# Altium schematic sheet Sheet2_Hierarquia.SchDoc
size A4; SheetNumber: 2; SheetTotal: 7
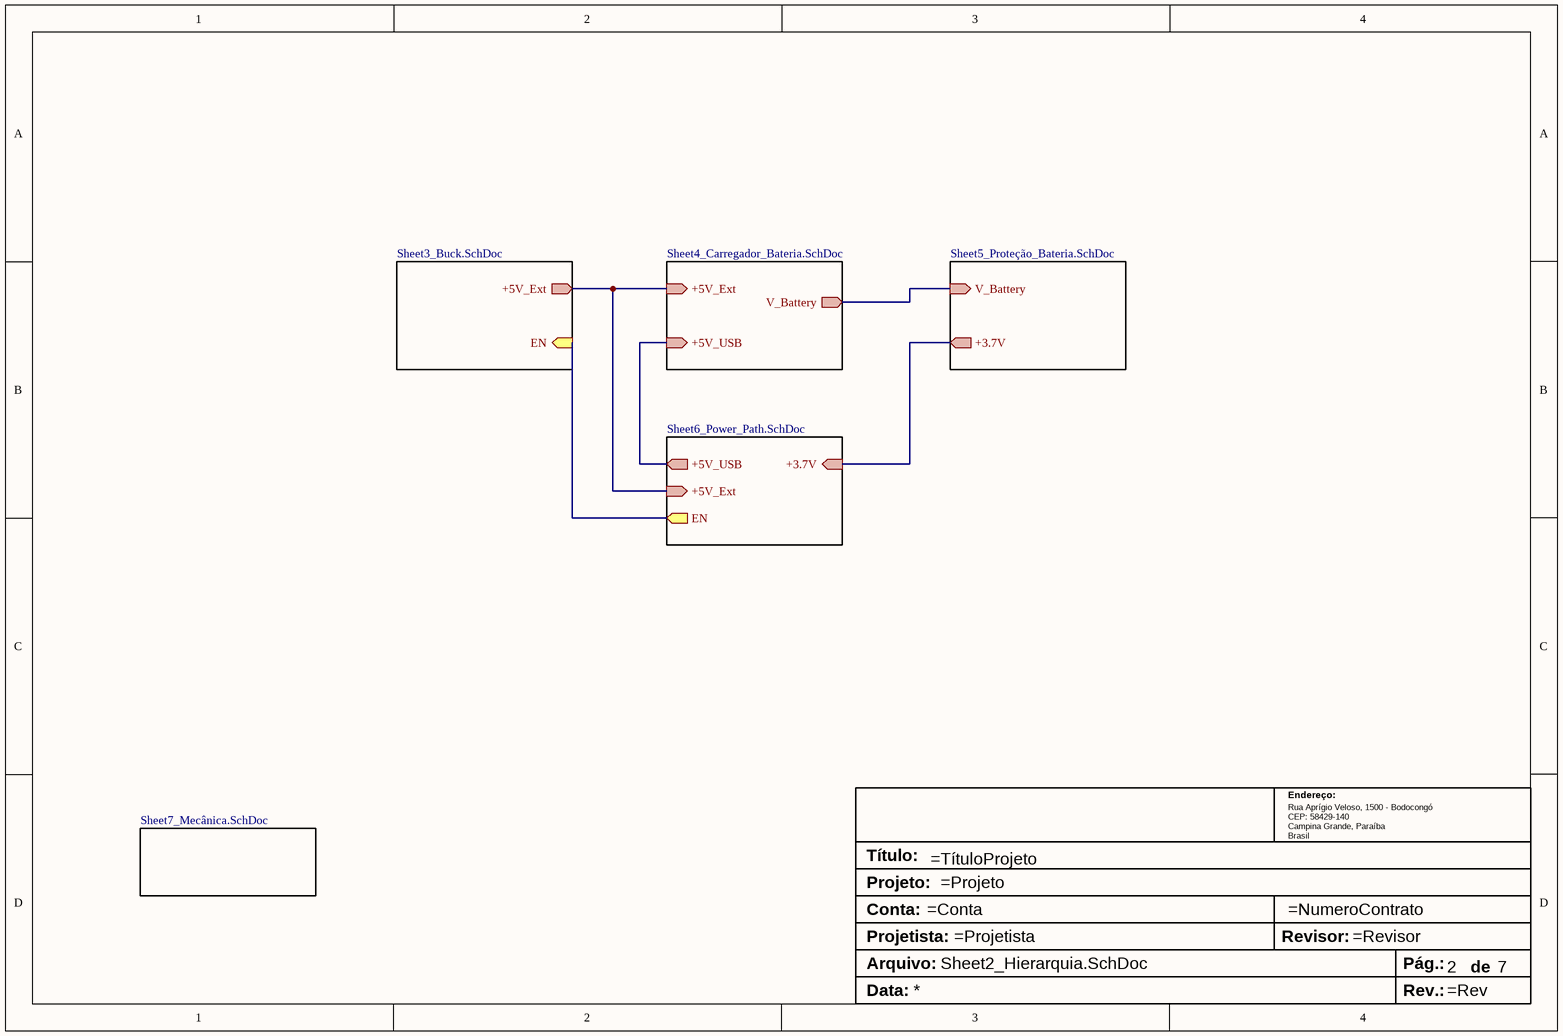
[diagram p0: Sheet2_Hierarquia.SchDoc]

## Parts
?  (no value)  (graphical)
TB?  Title Block  (value not drawn)  (graphical)

## Sub-sheets
Buck = Sheet3_Buck.SchDoc: EN (in), +5V_Ext (out)
Carregador_Bateria = Sheet4_Carregador_Bateria.SchDoc: +5V_Ext (in), +5V_USB (in), V_Battery (out)
Mecânica = Sheet7_Mecânica.SchDoc: no entries
Power_Path = Sheet6_Power_Path.SchDoc: +5V_Ext (in), +5V_USB (out), +3.7V (in), EN (out)
Proteção_Bateria = Sheet5_Proteção_Bateria.SchDoc: V_Battery (in), +3.7V (out)

## Nets
(unnamed): sheet Buck/EN, sheet Power_Path/EN
(unnamed): sheet Buck/+5V_Ext, sheet Carregador_Bateria/+5V_Ext, sheet Power_Path/+5V_Ext
(unnamed): sheet Carregador_Bateria/+5V_USB, sheet Power_Path/+5V_USB
(unnamed): sheet Carregador_Bateria/V_Battery, sheet Proteção_Bateria/V_Battery
(unnamed): sheet Proteção_Bateria/+3.7V, sheet Power_Path/+3.7V

## Notes on the sheet
- Título:
- Endereço:
- Rua Aprígio Veloso, 1500 - Bodocongó
  CEP: 58429-140
  Campina Grande, Paraíba
  Brasil
- Type @ to refer to a designator
- Projeto:
- Conta:
- Projetista:
- Arquivo:
- Data:
- Revisor:
- Pág.:
- Rev.:
- de
- (in symbol Title Block) Endereço:; Type @ to refer to a designator; Rua Aprígio Veloso, 1500 - Bodocongó / CEP: 58429-140 / Campina Grande, Paraíba / Brasil; Título:; Projeto:; Conta:; Projetista:; Revisor:; Arquivo:; Pág.:; de; Data:; Rev.:

## Library data of the parts
? = Title Block